# EAGLE design Safe Cracker Shield (EAGLE 7.7.0)
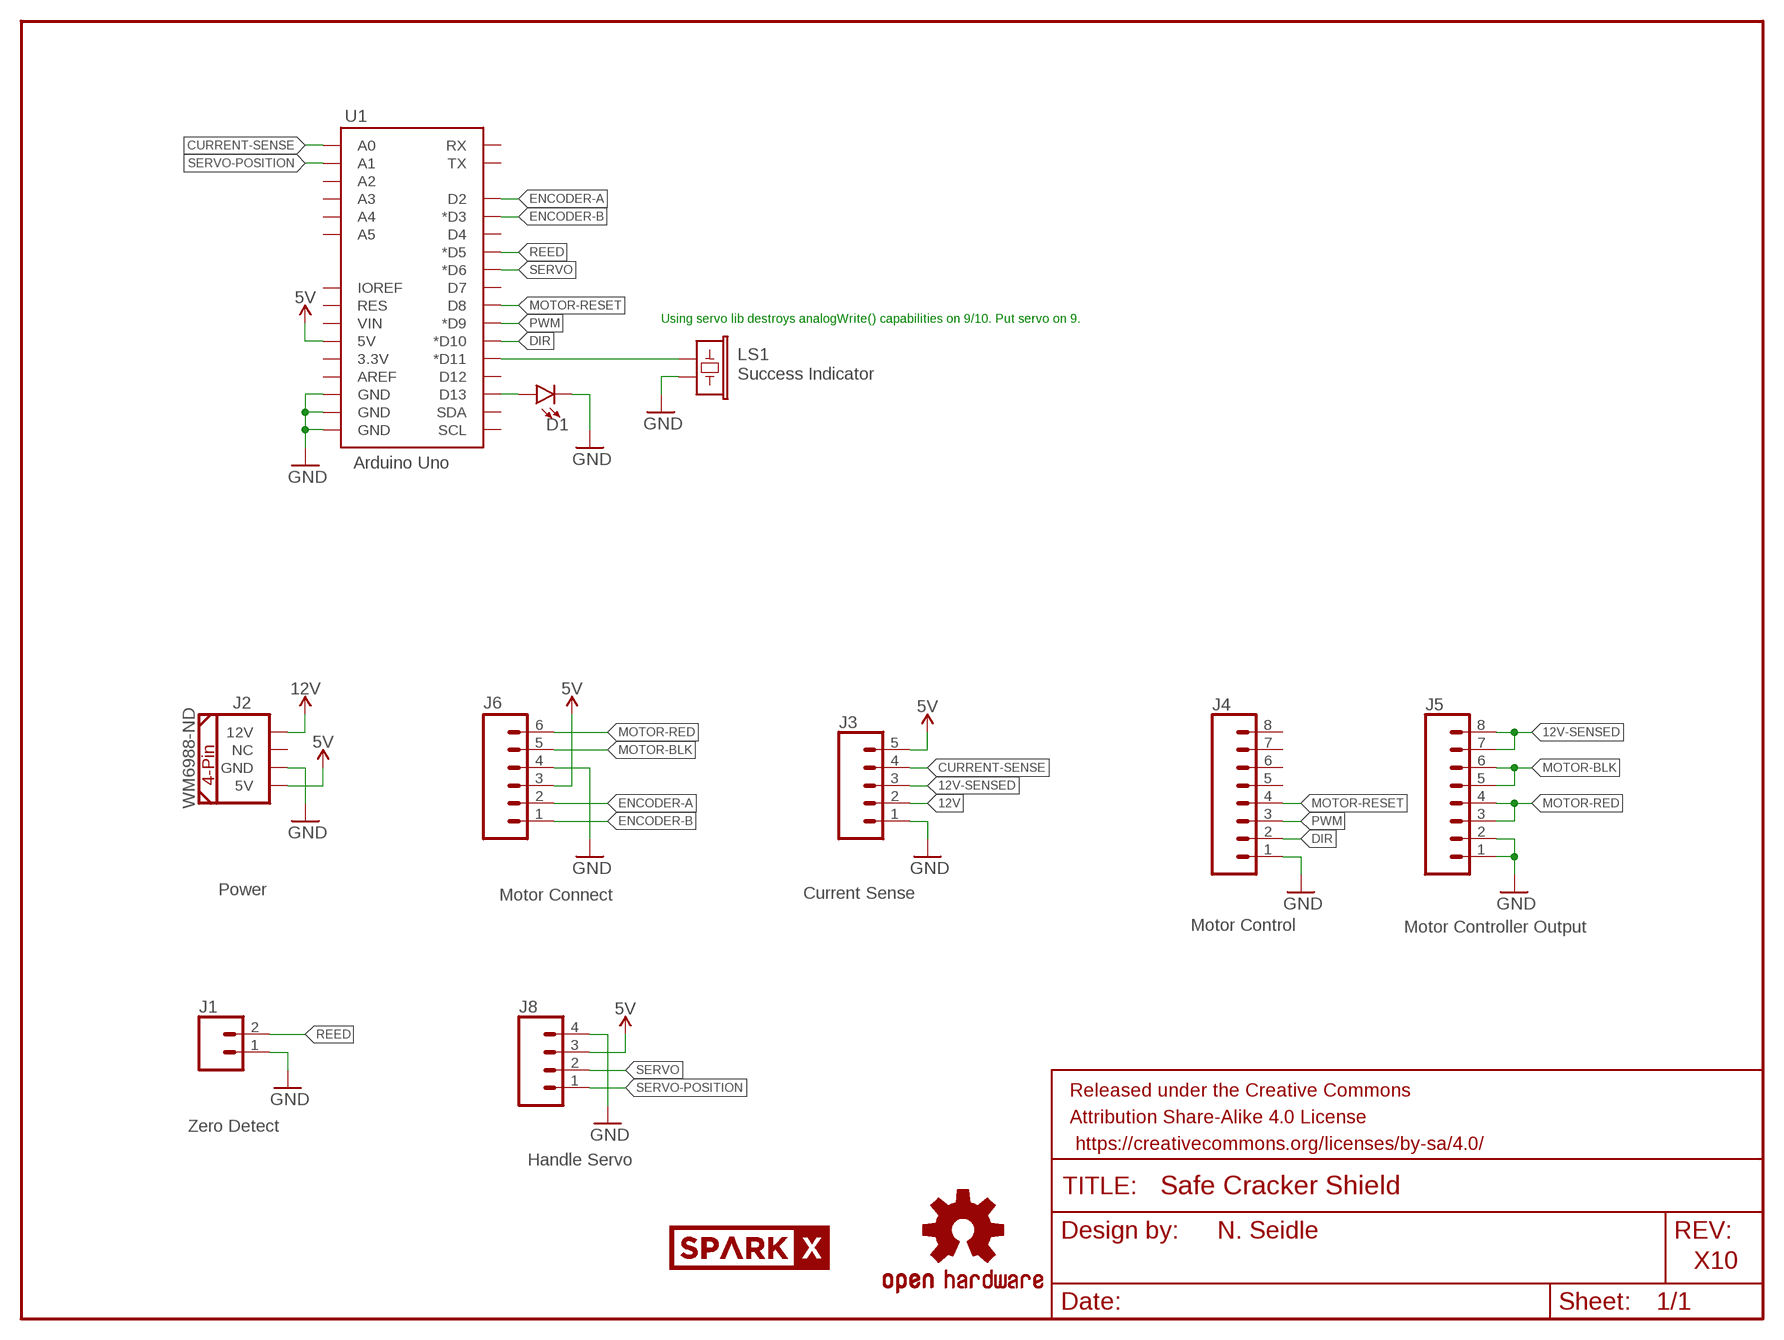
[diagram p0: schematic, sheet 1]

## Parts
D1  LED5MM  [LED_5MM]
FRAME1  FRAME-LETTER  [CREATIVE_COMMONS]
J1  Zero Detect  CONN_02JST-PTH-2  [JST-2-PTH]
J2  Power  COMPUTER-PERIPHERAL-POWERRA  [COMPUTER-PERIPHERAL-POWER-RA]
J3  Current Sense  CONN_05  [1X05]
J4  Motor Control  CONN_08"  [1X08]
J5  Motor Controller Output  CONN_08"  [1X08]
J6  Motor Connect  M06SILK_FEMALE_PTH  [1X06]
J8  Handle Servo  CONN_04  [1X04]
LOGO2  OSHW-LOGOS  [OSHW-LOGO-S]
LS1  Success Indicator  BUZZER-PTH  [BUZZER-12MM]
U1  Arduino Uno  ARDUINO_R3_SHIELDNOLABELS  [UNO_R3_SHIELD_NOLABELS]
U$1  SPARKX-LOGO4  [SPARKX-MEDIUM]

## Nets
5V: J2.5V J3.5 J6.3 J8.3 U1.5V
12V: J2.12V J3.2
12V-SENSED: J3.3 J5.7 J5.8
BUZZ: LS1.+ U1.D11(*D11)
CURRENT-SENSE: J3.4 U1.A0
DIR: J4.2 U1.D10(*D10)
ENCODER-A: J6.2 U1.D2
ENCODER-B: J6.1 U1.D3(*D3)
GND: D1.K(C) J1.1 J2.GND J3.1 J4.1 J5.1 J5.2 J6.4 J8.4 LS1.- U1.GND@0(GND) U1.GND@1(GND) U1.GND@2(GND)
MOTOR-BLK: J5.5 J5.6 J6.5
MOTOR-RED: J5.3 J5.4 J6.6
MOTOR-RESET: J4.4 U1.D8
N$1: D1.A U1.D13
PWM: J4.3 U1.D9(*D9)
REED: J1.2 U1.D5(*D5)
SERVO: J8.2 U1.D6(*D6)
SERVO-POSITION: J8.1 U1.A1
Unconnected: J2.NC J4.5 J4.6 J4.7 J4.8 U1.3.3V U1.A2 U1.A3 U1.A4 U1.A5 U1.AREF U1.D4 U1.D7 U1.D12 U1.IOREF U1.RES U1.RX U1.SCL U1.SDA U1.TX U1.VIN

## Notes on the sheet
- Using servo lib destroys analogWrite() capabilities on 9/10. Put servo on 9.
- WM6988-ND
- N. Seidle
- X10

## Library data of the parts
D1 = SparkFun-LED:LED: LED (Generic) Standard schematic elements and footprints for 5mm, 3mm, 1206, and 0603 sized LEDs. Generic LEDs with no color specified.
FRAME1 = SparkFun-Aesthetics:FRAME-LETTER: Schematic Frame - Letter Standard 8.5x11 US Letter frame
J1 = SparkFun-Connectors:CONN_02: Multi connection point. Often used as Generic Header-pin footprint for 0.1 inch spaced/style header connections On any of the 0.1 inch spaced packages, you can populate with these: Break Away Headers - Straight <https://www.sparkfun.com/products/116> (PRT-00116) Break Away Male Headers - Right Angle <https://www.sparkfun.com/products/553> (PRT-00553) Female Headers <https://www.sparkfun.com/products/115> (PRT-00115) Break Away Headers - Machine Pin <https://www.sparkfun.com/products/117> (PRT-00117) Break Away Female Headers - Swiss Machine Pin <https://www.sparkfun.com/products/743> (PRT-00743) For SCREWTERMINALS and SPRING TERMINALS visit here: Screw Terimnals on SparkFun.com <https://www.sparkfun.com/search/results?term=Screw+Terminals> (5mm/3.5mm/2.54mm spacing) This device is also useful as a general connection point to wire up your design to another part of your project. Our various solder wires solder well into these plated through hole pads. Hook-Up Wire - Assortment (Stranded, 22 AWG) <https://www.sparkfun.com/products/11375> (PRT-11375) Hook-Up Wire - Assortment (Solid Core, 22 AWG) <https://www.sparkfun.com/products/11367> (PRT-11367) View the entire wire category on our website here <https://www.sparkfun.com/categories/141> Special notes: Molex polarized connector foot print use with: PRT-08233 with associated crimp pins and housings. 2.54_SCREWTERM for use with PRT-10571. 3.5mm Screw Terminal footprints for PRT-08084 5mm Screw Terminal footprints for use with PRT-08432; PROD_ID: CONN-09863; SKU: PRT-09914
J2 = SparkFun-Connectors:COMPUTER-PERIPHERAL-POWER
J3 = SparkFun-Connectors:CONN_05: Multi connection point. Often used as Generic Header-pin footprint for 0.1 inch spaced/style header connections On any of the 0.1 inch spaced packages, you can populate with these: Break Away Headers - Straight <https://www.sparkfun.com/products/116> (PRT-00116) Break Away Male Headers - Right Angle <https://www.sparkfun.com/products/553> (PRT-00553) Female Headers <https://www.sparkfun.com/products/115> (PRT-00115) Break Away Headers - Machine Pin <https://www.sparkfun.com/products/117> (PRT-00117) Break Away Female Headers - Swiss Machine Pin <https://www.sparkfun.com/products/743> (PRT-00743) For SCREWTERMINALS and SPRING TERMINALS visit here: Screw Terimnals on SparkFun.com <https://www.sparkfun.com/search/results?term=Screw+Terminals> (5mm/3.5mm/2.54mm spacing) This device is also useful as a general connection point to wire up your design to another part of your project. Our various solder wires solder well into these plated through hole pads. Hook-Up Wire - Assortment (Stranded, 22 AWG) <https://www.sparkfun.com/products/11375> (PRT-11375) Hook-Up Wire - Assortment (Solid Core, 22 AWG) <https://www.sparkfun.com/products/11367> (PRT-11367) View the entire wire category on our website here <https://www.sparkfun.com/categories/141> Special notes: Molex polarized connector foot print use with SKU : PRT-08231 with associated crimp pins and housings. 1MM SMD Version SKU: PRT-10208
J4 J5 = SparkFun-Connectors:CONN_08: Multi connection point. Often used as Generic Header-pin footprint for 0.1 inch spaced/style header connections On any of the 0.1 inch spaced packages, you can populate with these: Break Away Headers - Straight <https://www.sparkfun.com/products/116> (PRT-00116) Break Away Male Headers - Right Angle <https://www.sparkfun.com/products/553> (PRT-00553) Female Headers <https://www.sparkfun.com/products/115> (PRT-00115) Break Away Headers - Machine Pin <https://www.sparkfun.com/products/117> (PRT-00117) Break Away Female Headers - Swiss Machine Pin <https://www.sparkfun.com/products/743> (PRT-00743) Arduino Stackable Header - 8 Pin <https://www.sparkfun.com/products/9279> (PRT-09279) For SCREWTERMINALS and SPRING TERMINALS visit here: Screw Terimnals on SparkFun.com <https://www.sparkfun.com/search/results?term=Screw+Terminals> (5mm/3.5mm/2.54mm spacing) This device is also useful as a general connection point to wire up your design to another part of your project. Our various solder wires solder well into these plated through hole pads. Hook-Up Wire - Assortment (Stranded, 22 AWG) <https://www.sparkfun.com/products/11375> (PRT-11375) Hook-Up Wire - Assortment (Solid Core, 22 AWG) <https://www.sparkfun.com/products/11367> (PRT-11367) View the entire wire category on our website here <https://www.sparkfun.com/categories/141> Special notes: Molex polarized connector foot print use with SKU : PRT-08231 with associated crimp pins and housings. 1MM SMD Version SKU: PRT-10208 NOTES ON THE VARIANTS LOCK and LOCK_LONGPADS... This footprint was designed to help hold the alignment of a through-hole component (i.e. 6-pin header) while soldering it into place. You may notice that each hole has been shifted either up or down by 0.005 of an inch from it's more standard position (which is a perfectly straight line). This slight alteration caused the pins (the squares in the middle) to touch the edges of the holes. Because they are alternating, it causes a "brace" to hold the component in place. 0.005 has proven to be the perfect amount of "off-center" position when using our standard breakaway headers. Although looks a little odd when you look at the bare footprint, once you have a header in there, the alteration is very hard to notice. Also,if you push a header all the way into place, it is covered up entirely on the bottom side.; PROD_ID: CONN-08438
J6 = SparkFun-Connectors:M06: Header 6 Standard 6-pin 0.1" header. Use with straight break away headers (SKU : PRT-00116), right angle break away headers (PRT-00553), swiss pins (PRT-00743), machine pins (PRT-00117), and female headers (PRT-00115). Molex polarized connector foot print use with SKU : PRT-08094 with associated crimp pins and housings. NOTES ON THE VARIANTS LOCK and LOCK_LONGPADS... This footprint was designed to help hold the alignment of a through-hole component (i.e. 6-pin header) while soldering it into place. You may notice that each hole has been shifted either up or down by 0.005 of an inch from it's more standard position (which is a perfectly straight line). This slight alteration caused the pins (the squares in the middle) to touch the edges of the holes. Because they are alternating, it causes a "brace" to hold the component in place. 0.005 has proven to be the perfect amount of "off-center" position when using our standard breakaway headers. Although looks a little odd when you look at the bare footprint, once you have a header in there, the alteration is very hard to notice. Also,if you push a header all the way into place, it is covered up entirely on the bottom side. This idea of altering the position of holes to aid alignment will be further integrated into the Sparkfun Library for other footprints. It can help hold any component with 3 or more connection pins.; PROD_ID: CONN-08437
J8 = SparkFun-Connectors:CONN_04: Multi connection point. Often used as Generic Header-pin footprint for 0.1 inch spaced/style header connections On any of the 0.1 inch spaced packages, you can populate with these: Break Away Headers - Straight <https://www.sparkfun.com/products/116> (PRT-00116) Break Away Male Headers - Right Angle <https://www.sparkfun.com/products/553> (PRT-00553) Female Headers <https://www.sparkfun.com/products/115> (PRT-00115) Break Away Headers - Machine Pin <https://www.sparkfun.com/products/117> (PRT-00117) Break Away Female Headers - Swiss Machine Pin <https://www.sparkfun.com/products/743> (PRT-00743) For SCREWTERMINALS and SPRING TERMINALS visit here: Screw Terimnals on SparkFun.com <https://www.sparkfun.com/search/results?term=Screw+Terminals> (5mm/3.5mm/2.54mm spacing) This device is also useful as a general connection point to wire up your design to another part of your project. Our various solder wires solder well into these plated through hole pads. Hook-Up Wire - Assortment (Stranded, 22 AWG) <https://www.sparkfun.com/products/11375> (PRT-11375) Hook-Up Wire - Assortment (Solid Core, 22 AWG) <https://www.sparkfun.com/products/11367> (PRT-11367) View the entire wire category on our website here <https://www.sparkfun.com/categories/141> Special notes: Molex polarized connector foot print use with SKU : PRT-08231 with associated crimp pins and housings. 1MM SMD Version SKU: PRT-10208; PROD_ID: CONN-09696
LOGO2 = SparkFun-Aesthetics:OSHW-LOGO: Open Source Hardware Logo This logo indicates the piece of hardware it is found on incorporates a OSHW license and/or adheres to the definition of open source hardware found here: http://freedomdefined.org/OSHW
LS1 = SparkFun-Electromechanical:BUZZER: Buzzer Small round buzzers that operate around the audible 2kHz range. You can use these as speakers to create simple music or user interfaces. Variant Overview: PTH - Mini Speaker - PC Mount 12mm 2.048kHz <https://www.sparkfun.com/products/7950> PTH_KIT - Mini Speaker - PC Mount 12mm 2.048kHz <https://www.sparkfun.com/products/7950> KIT simplifies soldering by adding stop mask to one side of the pads. PTH_NO_SILK - Mini Speaker - PC Mount 12mm 2.048kHz <https://www.sparkfun.com/products/7950> No silkscreen indicator of buzzer outline. PTH_KIT_NO_SILK - Mini Speaker - PC Mount 12mm 2.048kHz <https://www.sparkfun.com/products/7950> KIT package w/o silkscreen SMD - Buzzer Audio Magnetic (CCV-084B16) SMD buzzer used on, e.g. the LilyPad Buzzer <https://www.sparkfun.com/products/8463> and RFID USB Reader <https://www.sparkfun.com/products/9963>. SMD_KIT - Buzzer Audio Magnetic (CCV-084B16) SMD Buzzer with elongated pins to make soldering easier. Used on the SparkFun Simon Says - Surface Mount Soldering Kit <https://www.sparkfun.com/products/10935>.; PROD_ID: COMP-08253; SF_SKU: COM-07950
U1 = SparkFun-Boards:ARDUINO_R3_SHIELD: Shield form compatible with the Arduino Uno R3.
U$1 = SparkX:SPARKX-LOGO

## Net classes
1 power: width 0.203 mm

## Board
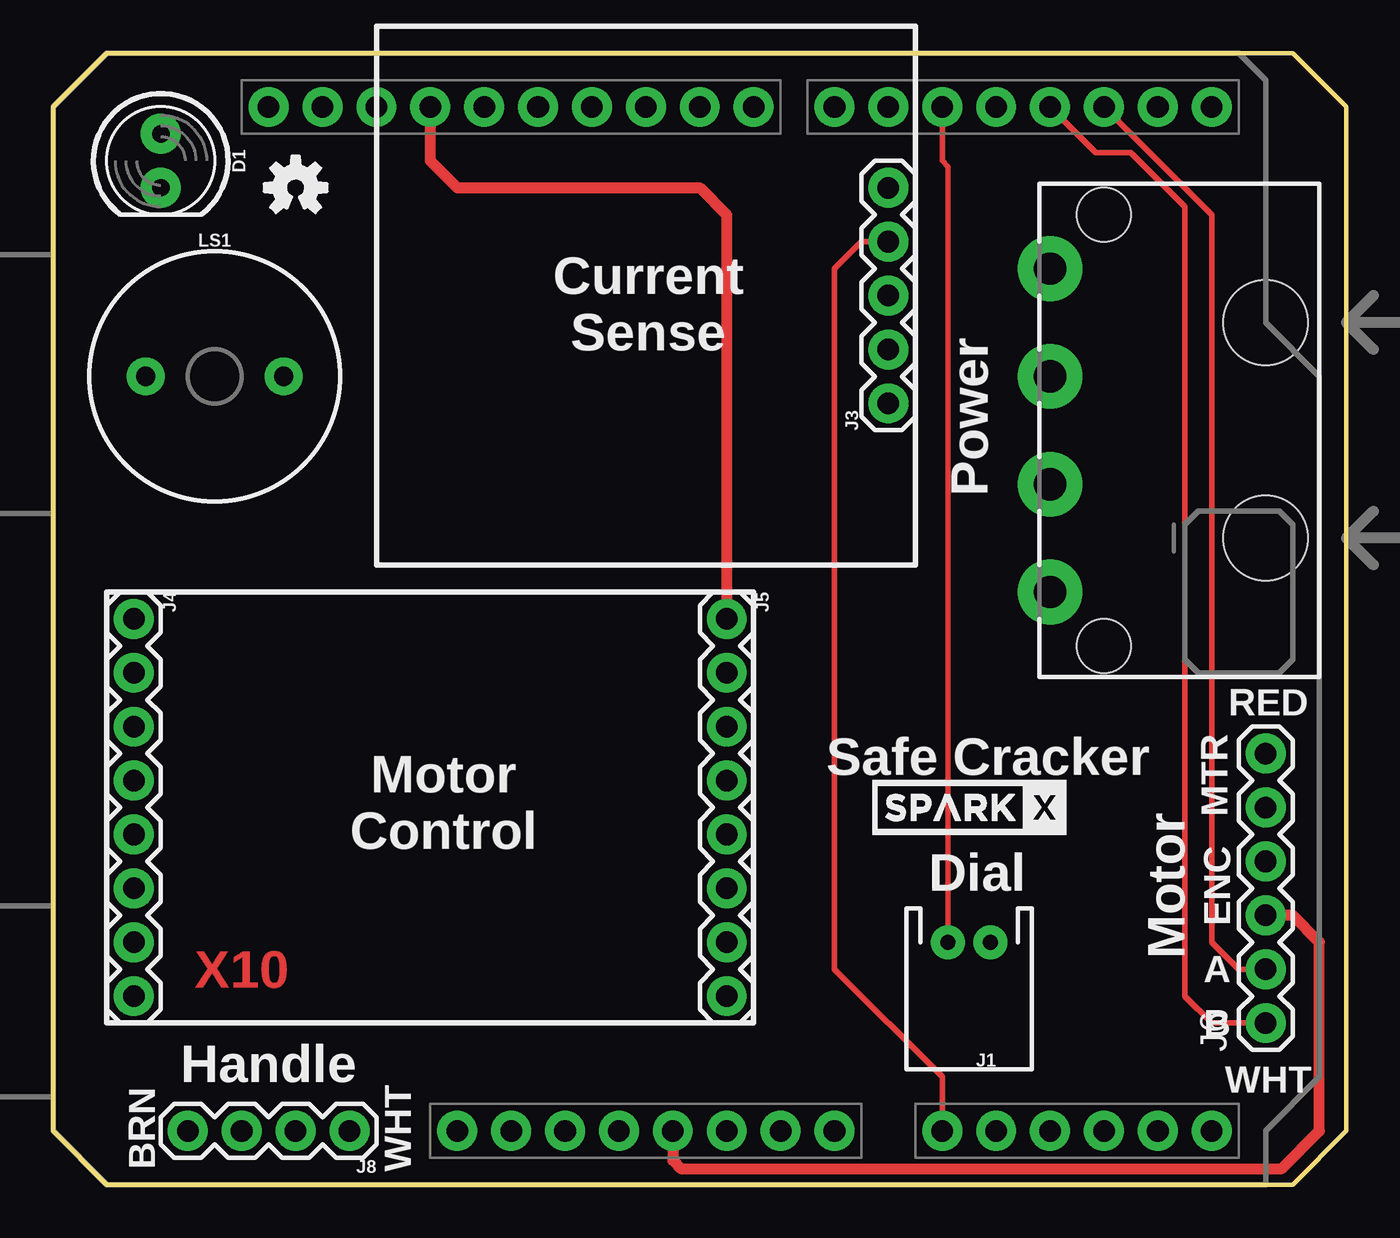
[diagram p1: board, top side]
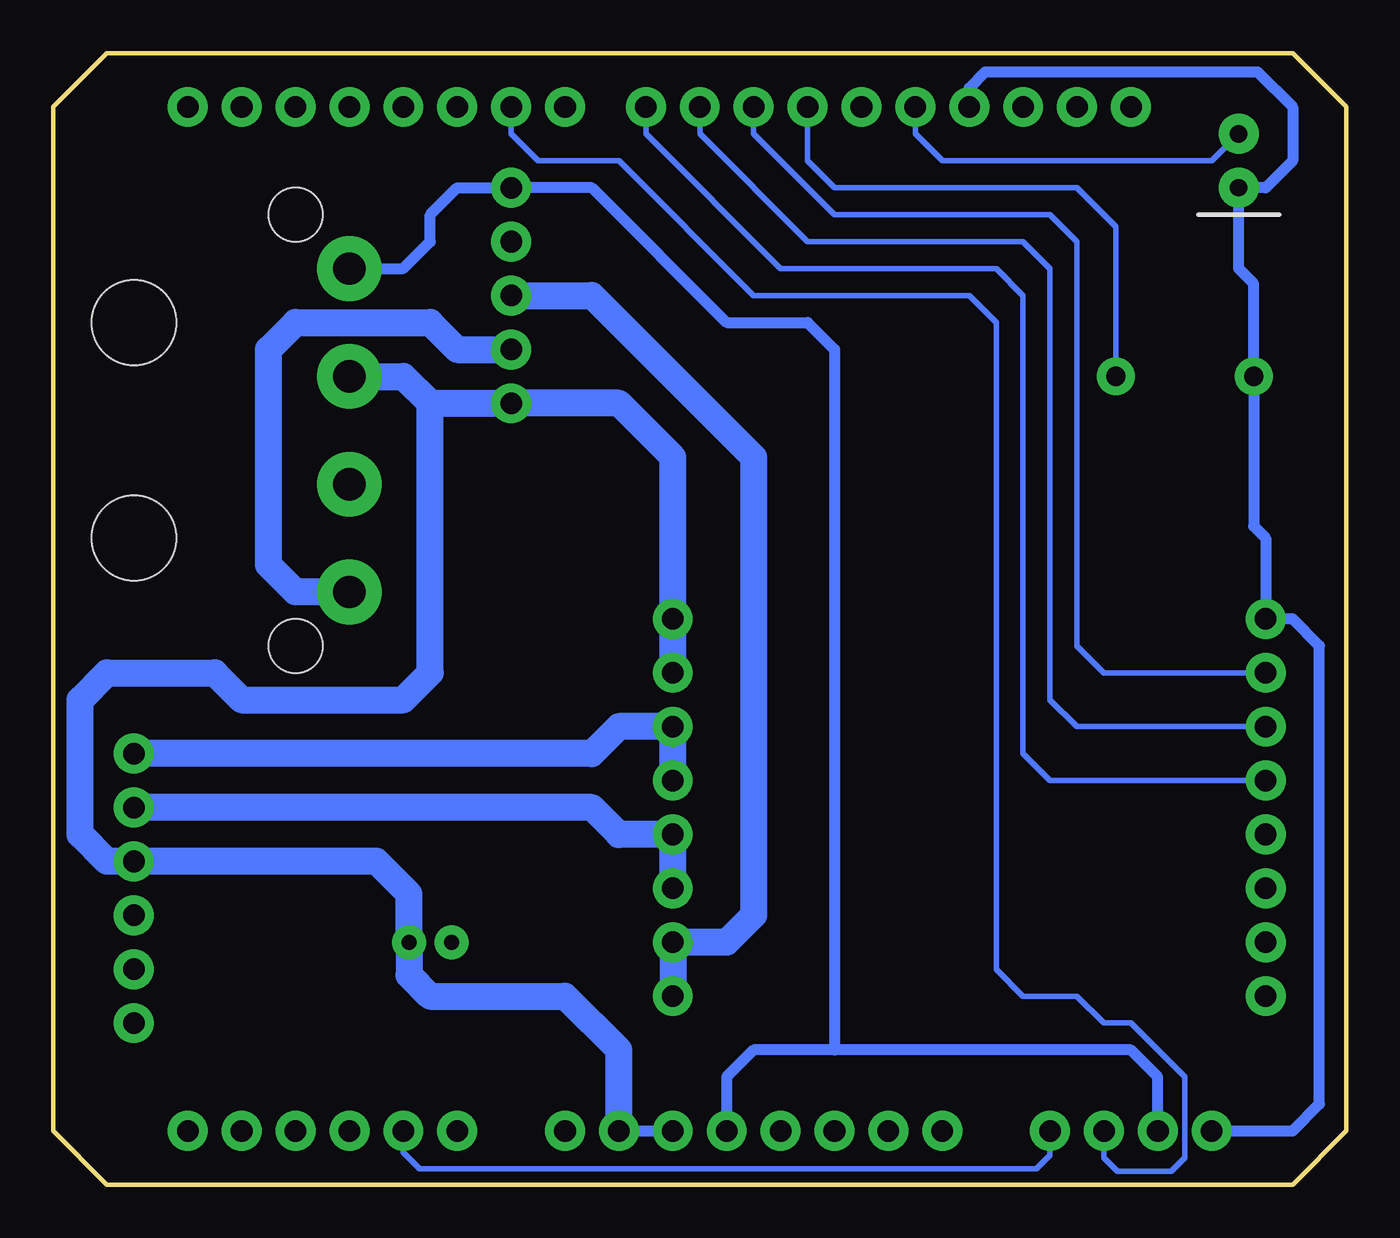
[diagram p2: board, bottom side, seen from below]

Size 60.96 x 53.34 mm. Coordinates in mm from the lower left corner, seen from the top.
Outline: 58.42,0 2.54,0 0,2.54 0,50.8 2.54,53.34 58.42,53.34 60.96,50.8 60.96,2.54 58.42,0
Copper layers (1*16): Top 0.035mm / dielectric 1.5mm / Bottom 0.035mm
Design rules "SparkFun-2-layer *": minimum track width 7mil, minimum drill 15mil, track to track 8mil, track to pad 8mil, pad to pad 8mil, via to via 8mil, smd to smd 8mil, copper to edge 8mil, drill to drill 8mil, minimum pad ring 12mil, minimum via ring 10mil, stop-mask expansion 4mil, vias tented up to drill 20mil, thermal gap 10mil

### Footprints (pad centres in the part's own frame; a part is rotated, then mirrored left to right if it is on the bottom)
LED_5MM = drill 0.813 pad 1.88: A -1.27,0; K 1.27,0
JST-2-PTH = drill 0.7 pad 1.6: 1 -1,0; 2 1,0
COMPUTER-PERIPHERAL-POWER-RA = drill 1.524 pad 3.048: 5V -7.62,-2.54; 12V 7.62,-2.54; GND -2.54,-2.54; NC 2.54,-2.54 | hole 2.54: -10.16,0; 10.16,0 | hole 3.988: -5.08,7.62; 5.08,7.62
1X05 = drill 1.016 pad 1.88: 1 0,0; 2 2.54,0; 3 5.08,0; 4 7.62,0; 5 10.16,0
1X08 = drill 1.016 pad 1.88: 1 0,0; 2 2.54,0; 3 5.08,0; 4 7.62,0; 5 10.16,0; 6 12.7,0; 7 15.24,0; 8 17.78,0
1X06 = drill 1.016 pad 1.88: 1 0,0; 2 2.54,0; 3 5.08,0; 4 7.62,0; 5 10.16,0; 6 12.7,0
1X04 = drill 1.016 pad 1.88: 1 0,0; 2 2.54,0; 3 5.08,0; 4 7.62,0
BUZZER-12MM = drill 0.9 pad 1.778: + 3.25,0; - -3.25,0
UNO_R3_SHIELD_NOLABELS = drill 1.016 pad 1.88: 3.3V 50.8,26.67; 5V 50.8,29.21; A0 50.8,41.91; A1 50.8,44.45; A2 50.8,46.99; A3 50.8,49.53; A4 50.8,52.07; A5 50.8,54.61; AREF 2.54,15.24; D2 2.54,49.53; D3 2.54,46.99; D4 2.54,44.45; D5 2.54,41.91; D6 2.54,39.37; D7 2.54,36.83; D8 2.54,33.02; D9 2.54,30.48; D10 2.54,27.94; D11 2.54,25.4; D12 2.54,22.86; D13 2.54,20.32; GND@0 50.8,31.75; GND@1 50.8,34.29; GND@2 2.54,17.78; IOREF 50.8,21.59; NC 50.8,19.05; RES 50.8,24.13; RX 2.54,54.61; SCL 2.54,10.16; SDA 2.54,12.7; TX 2.54,52.07; VIN 50.8,36.83

### Placement (x,y rotation side)
D1  5.08,48.26 270 top
FRAME1  6.35,-24.13 0 top  (outside the outline)
J1  43.18,11.43 180 top
J2  49.53,35.56 270 top
J3  39.37,36.83 90 top
J4  3.81,26.67 270 top
J5  31.75,26.67 270 top
J6  57.15,7.62 90 top
J8  13.97,2.54 180 top
LOGO2  11.43,46.99 0 top
LS1  7.62,38.1 0 top
U1  0,53.34 270 top
U$1  43.18,17.78 0 top

### Tracks (layer width: path | path; a pad name or v marks a point on that pad's centre or on a via)
5V
  Top 0.508: U1.5V 29.21,1.14 29.59,0.76 57.91,0.76 59.69,2.54 59.69,11.43 58.42,12.7 J6.3
  Bottom 0.508: J2.5V 44.45,43.18 43.18,44.45 43.18,45.72 41.91,46.99 J3.5 35.56,46.99 29.21,40.64 25.4,40.64 24.13,39.37 24.13,6.35 | J8.3 8.89,5.08 10.16,6.35 24.13,6.35 | 24.13,6.35 27.94,6.35 29.21,5.08 U1.5V
12V
  Bottom 1.27: J3.2 41.91,39.37 43.18,40.64 49.53,40.64 50.8,39.37 50.8,29.21 49.53,27.94 J2.12V
12V-SENSED
  Bottom 1.27: J3.3 35.56,41.91 27.94,34.29 27.94,12.7 29.21,11.43 J5.7 J5.8
BUZZ
  Bottom 0.254: LS1.+ 10.87,45.16 12.7,46.99 24.13,46.99 25.4,48.26 U1.D11
CURRENT-SENSE
  Top 0.254: U1.A0 41.91,5.08 36.83,10.16 36.83,43.18 38.1,44.45 J3.4
DIR
  Bottom 0.254: U1.D10 27.94,49.53 24.13,45.72 13.97,45.72 12.7,44.45 12.7,25.4 11.43,24.13 J4.2
ENCODER-A
  Top 0.254: J6.2 55.88,10.16 54.61,11.43 54.61,45.72 U1.D2
ENCODER-B
  Top 0.254: J6.1 54.61,7.62 53.34,8.89 53.34,46.1 50.8,48.64 49.15,48.64 U1.D3
GND
  Top 0.508: U1.GND@2 17.78,48.26 19.05,46.99 30.48,46.99 31.75,45.72 J5.1
  Bottom 0.508: J8.4 2.54,2.54 1.27,3.81 1.27,25.4 2.54,26.67 J4.1 3.81,30.48 4.37,31.04 LS1.- 4.37,42.47 5.08,43.18 D1.K 3.81,46.99 2.54,48.26 2.54,50.8 4.19,52.45 17.02,52.45 17.78,51.69 U1.GND@2 | U1.GND@1 U1.GND@0
  Bottom 1.27: J5.2 J5.1 31.75,34.29 34.29,36.83 J3.1 43.18,36.83 | J2.GND 44.45,38.1 43.18,36.83 | 43.18,36.83 43.18,24.13 44.45,22.86 52.07,22.86 53.34,24.13 58.42,24.13 59.69,22.86 59.69,16.51 58.42,15.24 J6.4 45.72,15.24 44.18,13.7 J1.1 44.18,9.89 43.18,8.89 36.83,8.89 34.29,6.35 U1.GND@1
MOTOR-BLK
  Bottom 1.27: J6.5 35.56,17.78 34.29,16.51 J5.5 J5.6
MOTOR-RED
  Bottom 1.27: J6.6 35.56,20.32 34.29,21.59 J5.3 J5.4
MOTOR-RESET
  Bottom 0.254: J4.4 13.97,19.05 15.24,20.32 15.24,41.91 16.51,43.18 26.67,43.18 33.02,49.53 U1.D8
N$1
  Bottom 0.254: U1.D13 20.32,49.53 19.05,48.26 6.35,48.26 D1.A
PWM
  Bottom 0.254: J4.3 12.7,21.59 13.97,22.86 13.97,43.18 15.24,44.45 25.4,44.45 30.48,49.53 U1.D9
REED
  Top 0.254: J1.2 42.18,47.99 41.91,48.26 U1.D5
SERVO
  Bottom 0.254: U1.D6 39.37,49.53 38.1,48.26 34.29,48.26 27.94,41.91 17.78,41.91 16.51,40.64 16.51,10.16 15.24,8.89 12.7,8.89 11.43,7.62 10.16,7.62 7.62,5.08 7.62,1.27 8.26,0.64 10.79,0.64 11.43,1.27 J8.2
SERVO-POSITION
  Bottom 0.254: U1.A1 44.45,1.52 43.69,0.76 14.61,0.76 13.97,1.4 J8.1

### Text on the board
Top: X10
tPlace: Current / Sense | Power | RED | Safe Cracker | MTR | Motor / Control | Dial | Motor | ENC | A | B | Handle | WHT | BRN | WHT